# EAGLE design StepDown (EAGLE 6.2)
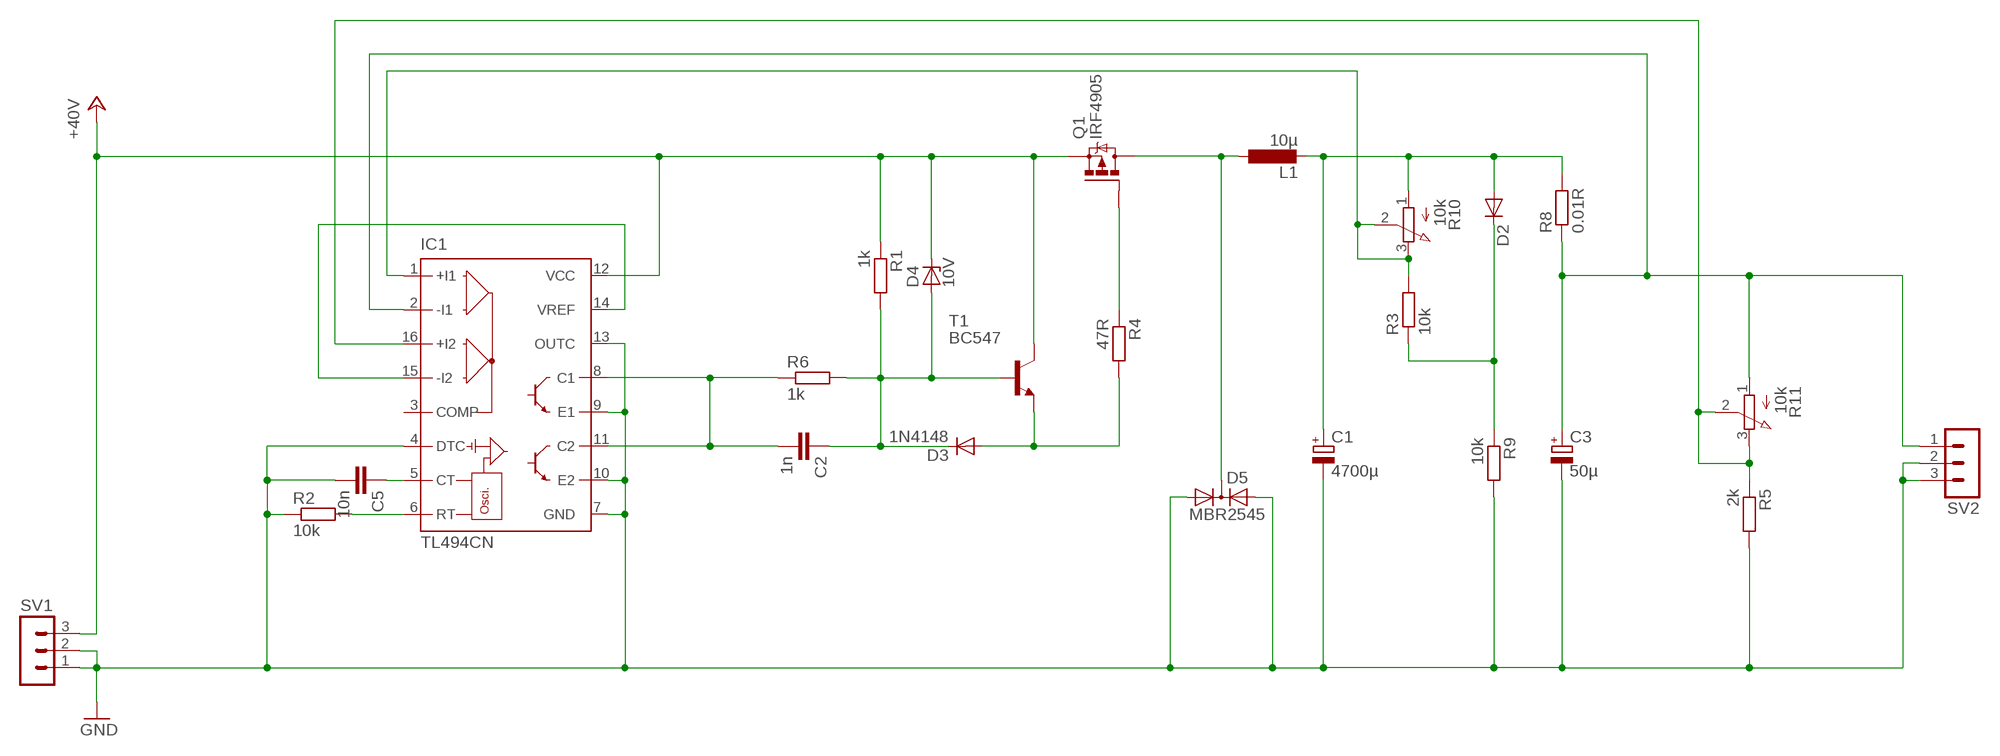
[diagram p0: schematic, sheet 1]

## Parts
C1  4700µ  CPOL-EUE10-20  [EB20D]
C2  1n  C-EU025-040X050  [C025-040X050]
C3  50µ  CPOL-EUE2.5-7  [E2,5-7]
C5  10n  C-EU075-032X103  [C075-032X103]
D2  DIODE-D-10  [D-10]
D3  1N4148  DIODE-D-2.5  [D-2.5]
D4  10V  ZENER-DIODEZD-2.5  [ZDIO-2.5]
D5  MBR2545  DIODE-2AC|CATO3P  [TO3P]
IC1  TL494CN  [DIL16]
L1  10µ  L-EUTFI0307  [TFI0307]
Q1  IRF4905  [TO220BH]
R1  1k  R-EU_0204/2V  [0204V]
R2  10k  R-EU_0204/2V  [0204V]
R3  10k  R-EU_0204/2V  [0204V]
R4  47R  R-EU_0204/2V  [0204V]
R5  2k  R-EU_0207/12  [0207/12]
R6  1k  R-EU_0204/2V  [0204V]
R8  0.01R  R-EU_0617/5V  [0617V]
R9  10k  R-EU_0204/2V  [0204V]
R10  10k  EVUE2A  [EVUE]
R11  10k  EVUE2A  [EVUE]
SV1  MA03-1  [MA03-1]
SV2  MA03-1  [MA03-1]
T1  BC547  BC547-NPN-TO92-CBE  [TO92-CBE]

## Nets
+24V: D4.C IC1.12(VCC) Q1.S R1.1 SV1.3 T1.C ; supply symbol labelled +40V
GND: C1.- C3.- C5.2 D5.1(A1) D5.3(A2) IC1.4(DTC) IC1.7(GND) IC1.9(E1) IC1.10(E2) IC1.13(OUTC) R2.1 R5.2 R9.2 SV1.1 SV1.2 SV2.2 SV2.3
N$1: C2.2 IC1.8(C1) IC1.11(C2) R6.1
N$2: C5.1 IC1.5(CT)
N$3: IC1.14(VREF) IC1.15(-I2)
N$4: C1.+ D2.A L1.2 R8.2 R10.1(A)
N$5: IC1.1(+I1) R3.2 R10.2(S) R10.3(E)
N$6: IC1.6(RT) R2.2
N$7: D3.A R4.2 T1.E
N$8: C2.1 D3.C D4.A R1.2 R6.2 T1.B
N$9: D5.2(C) L1.1 Q1.D
N$10: C3.+ IC1.2(-I1) R8.1 R11.1(A) SV2.1
N$11: IC1.16(+I2) R5.1 R11.2(S) R11.3(E)
N$13: D2.C R3.1 R9.1
N$14: Q1.G R4.1
Unconnected: IC1.3(COMP)

## Library data of the parts
C1 C3 = rcl:CPOL-EU: POLARIZED CAPACITOR, European symbol
C2 C5 = rcl:C-EU: CAPACITOR, European symbol
D2 D3 = diode:DIODE-: DIODE
D4 = diode:ZENER-DIODE: Z-Diode
D5 = diode:DIODE-2AC|CA: Dual DIODE Anode-Cathode|Cathode-Anode
IC1 = linear:TL494*: SWITCHMODE Pulse Width Modulation Control Circuit NCV494B http://onsemi.com tl494-d.pdf
L1 = rcl:L-EU: INDUCTOR, European symbol
Q1 = transistor-power:IRF4905: P-Channel HEXFET® Power MOSFET RDS(on)= 0.02 Ohm, ID = -74A Source: http://www.irf.com/product-info/datasheets/data/irf4905pbf.pdf
R1-R6 R8 R9 = rcl:R-EU_: RESISTOR, European symbol
R10 R11 = pot:EVU: 9 mm Square Rotary Potentiometers Source: Panasonic
SV1 SV2 = con-lstb:MA03-1: PIN HEADER; OC_FARNELL: unknown; OC_NEWARK: unknown
T1 = transistor:*-NPN-: NPN Transistror BF959 corrected 2008.03.06

## Board
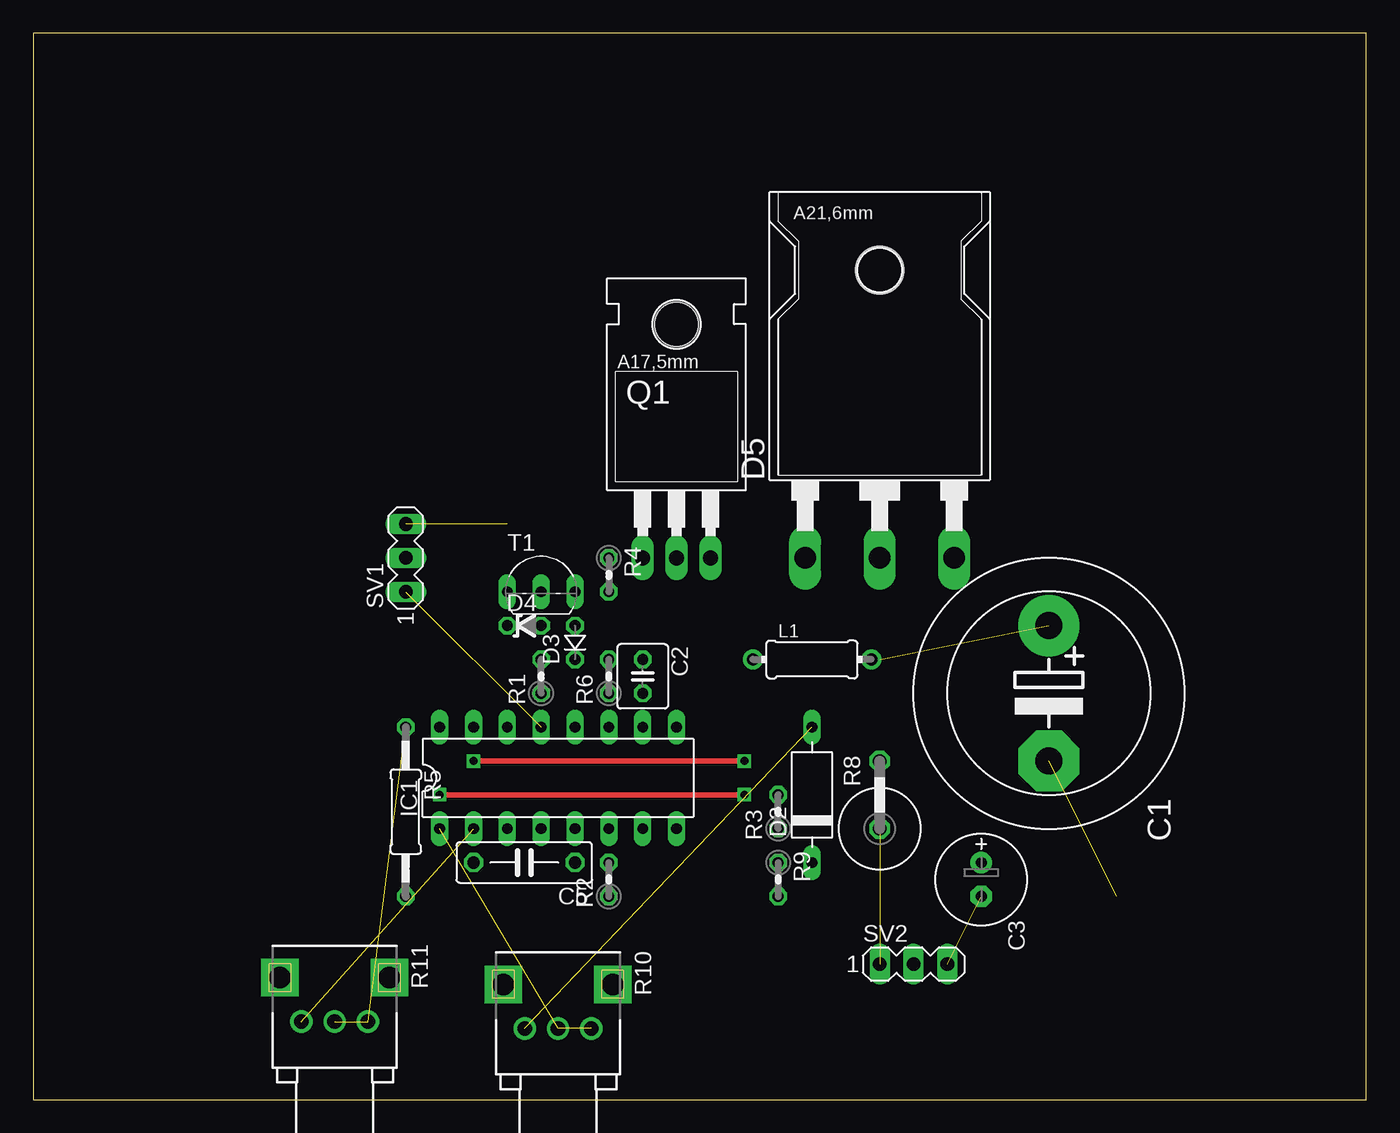
[diagram p1: board, top side]
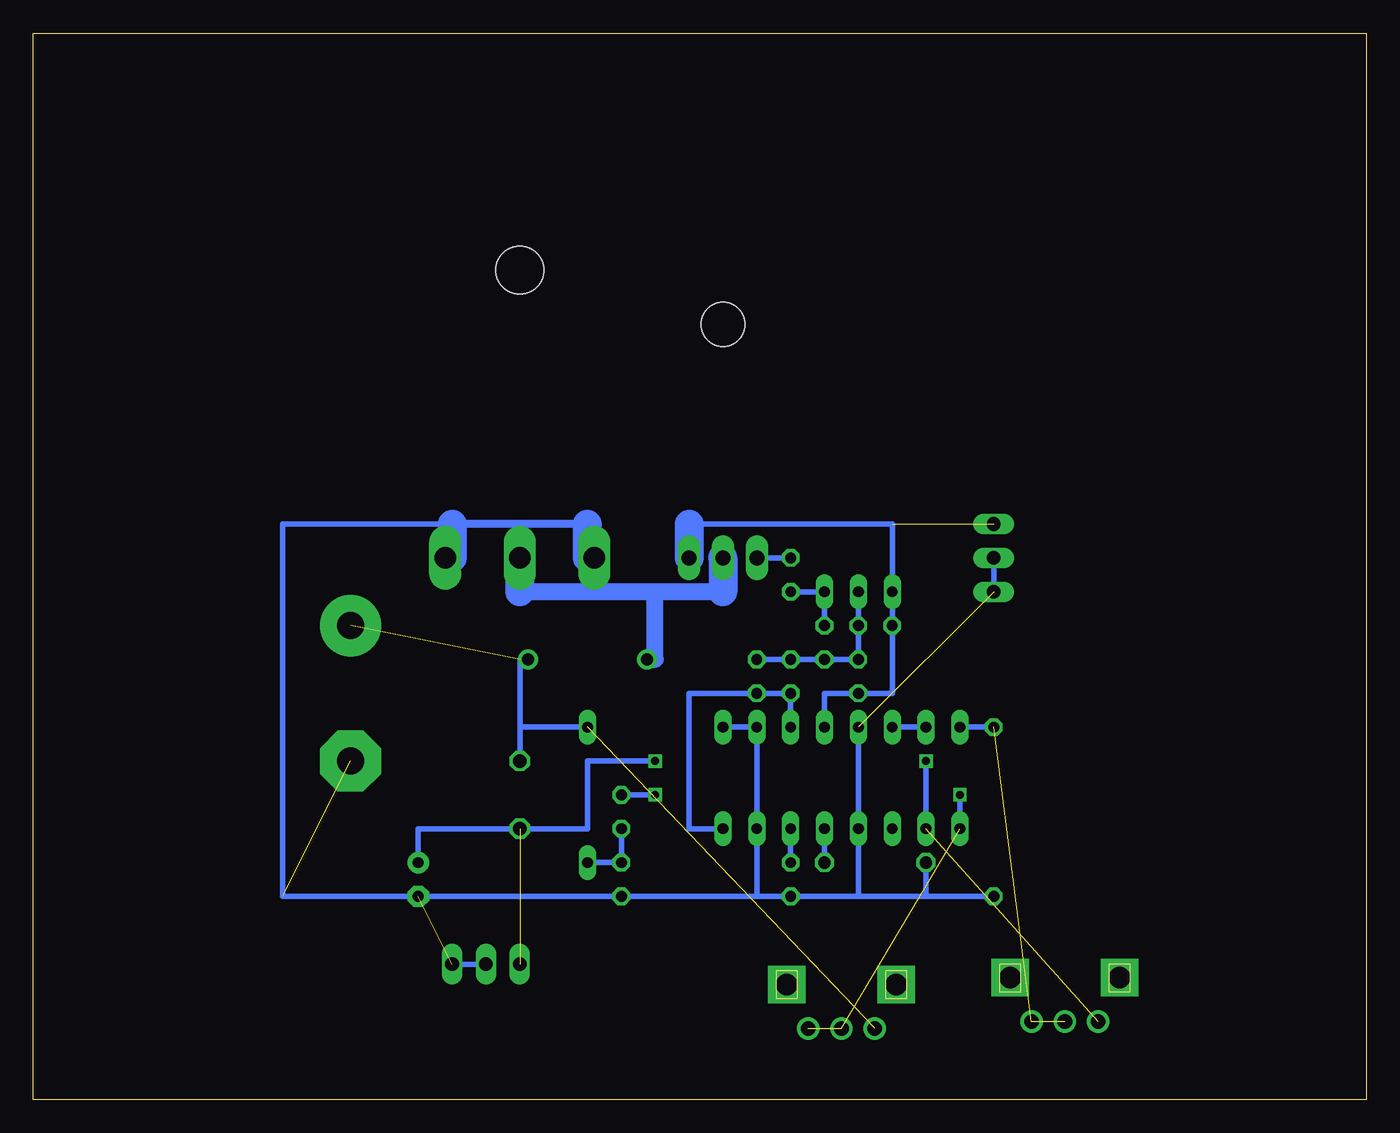
[diagram p2: board, bottom side, seen from below]

Size 100 x 80 mm. Coordinates in mm from the lower left corner, seen from the top.
Outline: 0,0 100,0 100,80 0,80 0,0
Copper layers (1*16): Top 0.035mm / dielectric 1.5mm / Bottom 0.035mm
Design rules: minimum track width 10mil, minimum drill 24mil, track to track 8mil, track to pad 8mil, pad to pad 8mil, via to via 8mil, smd to smd 8mil, copper to edge 40mil, drill to drill 8mil, minimum pad ring 10mil, minimum via ring 8mil, stop-mask expansion 4mil, vias tented up to drill 0mil, thermal gap 10mil

### Footprints (pad centres in the part's own frame; a part is rotated, then mirrored left to right if it is on the bottom)
EB20D = drill 2.007 pad 4.597: + -5.08,0 | drill 2.007 pad 4.597 octagon: - 5.08,0
C025-040X050 = drill 0.813 octagon: 1 -1.27,0; 2 1.27,0
E2,5-7 = drill 0.813 pad 1.6: + -1.27,0 | drill 0.813 pad 1.6 octagon: - 1.27,0
C075-032X103 = drill 0.914 octagon: 1 -3.81,0; 2 3.81,0
D-10 = drill 0.813 long: A 5.08,0; C -5.08,0
D-2.5 = drill 0.813 octagon: A 1.27,0; C -1.27,0
ZDIO-2.5 = drill 0.813 octagon: A 1.27,0; C -1.27,0
TO3P = drill 1.6 long: 1 -5.588,-7.62; 2 0,-7.62; 3 5.588,-7.62 | hole 3.607: 0,13.97
DIL16 = drill 0.813 long: 1 -8.89,-3.81; 2 -6.35,-3.81; 3 -3.81,-3.81; 4 -1.27,-3.81; 5 1.27,-3.81; 6 3.81,-3.81; 7 6.35,-3.81; 8 8.89,-3.81; 9 8.89,3.81; 10 6.35,3.81; 11 3.81,3.81; 12 1.27,3.81; 13 -1.27,3.81; 14 -3.81,3.81; 15 -6.35,3.81; 16 -8.89,3.81
TFI0307 = drill 0.9 pad 1.5: 1 -4.445,0; 2 4.445,0
TO220BH = drill 1.118 long: D 0,-6.35; G -2.54,-6.35; S 2.54,-6.35 | hole 3.302: 0,11.176
0204V = drill 0.813 octagon: 1 -1.27,0; 2 1.27,0
0207/12 = drill 0.813 octagon: 1 -6.35,0; 2 6.35,0
0617V = drill 1.016 octagon: 1 -2.54,0; 2 2.54,0
EVUE = drill 1.1 pad 1.676: 1 0,-2.5; 2 0,0; 3 0,2.5 | drill 1.6 pad 2.8 square: M1 -3.3,4.1; M2 -3.3,-4.1
MA03-1 = drill 1.016 long: 1 -2.54,0; 2 0,0; 3 2.54,0
TO92-CBE = drill 0.813 long: B 0,0; C -2.54,0; E 2.54,0

### Placement (x,y rotation side)
C1  76.2,30.48 270 top
C2  45.72,31.75 270 top
C3  71.12,16.51 270 top
C5  36.83,17.78 180 top
D2  58.42,22.86 90 top
D3  40.64,34.29 90 top
D4  36.83,35.56 0 top
D5  63.5,48.26 0 top
IC1  39.37,24.13 0 top
L1  58.42,33.02 0 top
Q1  48.26,46.99 0 top
R1  38.1,31.75 90 top
R2  43.18,16.51 90 top
R3  55.88,21.59 90 top
R4  43.18,39.37 270 top
R5  27.94,21.59 270 top
R6  43.18,31.75 90 top
R8  63.5,22.86 90 top
R9  55.88,16.51 270 top
R10  39.37,5.33 270 top
R11  22.61,5.84 270 top
SV1  27.94,40.64 90 top
SV2  66.04,10.16 0 top
T1  38.1,38.1 0 top

### Tracks (layer width: path | path; a pad name or v marks a point on that pad's centre or on a via)
+24V  (1 unrouted)
  Bottom 0.406: 50.8,43.18 35.56,43.18 T1.C D4.C 35.56,30.48 R1.1 40.64,30.48 IC1.12
  Bottom 2.184: 50.8,43.18 Q1.S
GND  (3 unrouted)
  Bottom 0.406: IC1.9 IC1.10 IC1.7 45.72,15.24 | 45.72,15.24 R2.1 38.1,15.24 | SV1.1 SV1.2 | R5.2 33.02,15.24 | 33.02,15.24 38.1,15.24 | IC1.13 IC1.4 38.1,15.24 | SV2.3 SV2.2 | 45.72,15.24 R9.2 C3.- 81.28,15.24 81.28,43.18 68.58,43.18 | C5.2 33.02,15.24
  Bottom 0.61: 58.42,43.18 68.58,43.18
  Bottom 2.184: D5.1 58.42,40.64 58.42,43.18 | 68.58,43.18 68.58,40.64 D5.3
N$1
  Bottom 0.406: IC1.11 R6.1 C2.2 50.8,30.48 50.8,20.32 IC1.8
N$2
  Bottom 0.406: IC1.5 C5.1
N$3
  Bottom 0.406: IC1.15 IC1.14
N$4  (2 unrouted)
  Bottom 0.406: D2.A 63.5,27.94 R8.2 63.5,33.02 L1.2
N$5  (via drill 0.6)  (2 unrouted)
  Top 0.406: v30.48,22.86 v53.34,22.86
  Bottom 0.406: IC1.1 v30.48,22.86 | R3.2 v53.34,22.86
N$6
  Bottom 0.406: IC1.6 R2.2
N$7
  Bottom 0.406: D3.A T1.E R4.2
N$8
  Bottom 0.406: T1.B D4.A R1.2 D3.C R6.2 C2.1
N$9
  Bottom 1.27: 48.26,38.1 53.34,38.1 | 53.34,38.1 63.5,38.1 | L1.1 53.34,33.02 53.34,38.1
  Bottom 2.184: Q1.D 48.26,38.1 | 63.5,38.1 D5.2
N$10  (via drill 0.6)  (2 unrouted)
  Top 0.406: v33.02,25.4 v53.34,25.4
  Bottom 0.406: IC1.2 v33.02,25.4 | C3.+ 71.12,20.32 R8.1 58.42,20.32 58.42,25.4 v53.34,25.4
N$11  (2 unrouted)
  Bottom 0.406: IC1.16 R5.1
N$13
  Bottom 0.406: R3.1 R9.1 D2.C
N$14
  Bottom 0.406: Q1.G R4.1